# Altium schematic sheet Sensors.SchDoc
size A4
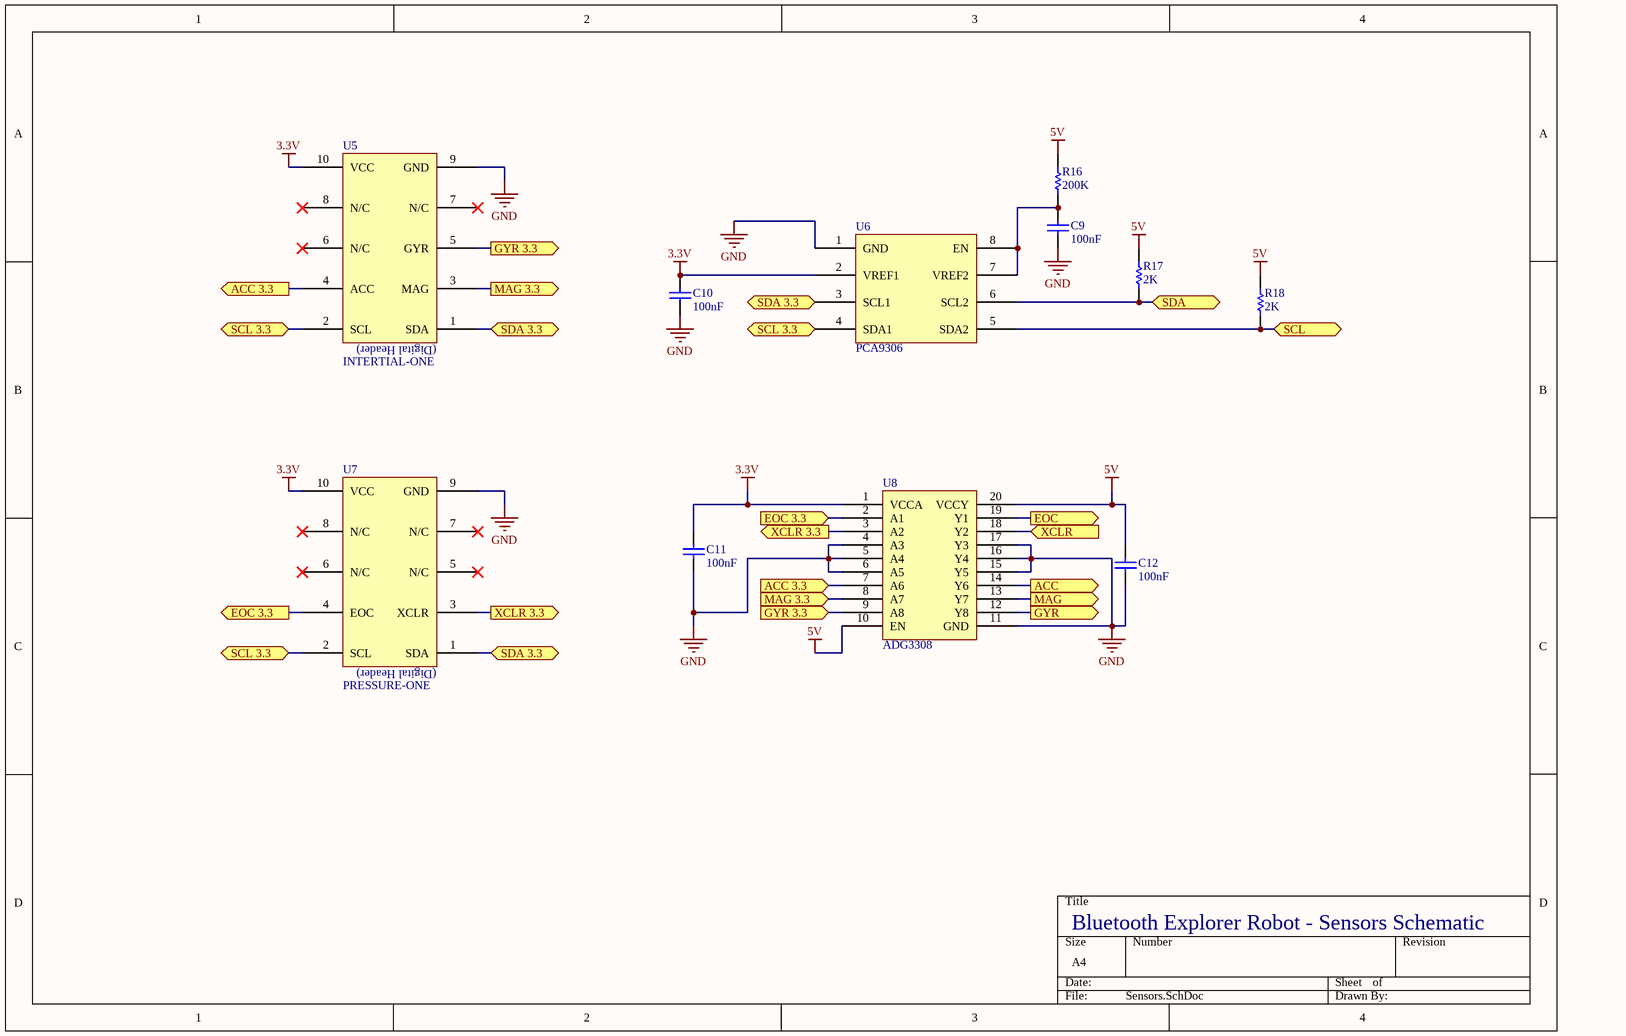
[diagram p0: Sensors.SchDoc]

## Parts
C9  value 100nF  [0805]
C10  value 100nF  [0805]
C11  value 100nF  [0805]
C12  value 100nF  [0805]
R16  value 200K  [2012[0805]]  (hidden comment: Res Semi)
R17  value 2K  [2012[0805]]  (hidden comment: Res Semi)
R18  value 2K  [2012[0805]]  (hidden comment: Res Semi)
U5  INTERTIAL-ONE  [ATMEL-SENS]
U6  PCA9306  [us8]
U7  PRESSURE-ONE  [ATMEL-SENS]
U8  ADG3308  [TSSOP20]

## Ports
ACC 3.3 (in), ACC 3.3 (out), ACC (out), EOC 3.3 (in), EOC 3.3 (out), EOC (out), GYR 3.3 (in), GYR 3.3 (out), GYR (out), MAG 3.3 (in), MAG 3.3 (out), MAG (out), SCL 3.3 (bidir), SCL (bidir), SDA 3.3 (bidir), SDA (bidir), XCLR 3.3 (out), XCLR (in)

## Nets
3.3V: C10.1 C11.1 U5.10(VCC) U6.2(VREF1) U7.10(VCC) U8.1(VCCA)
5V: C12.1 R16.2 R17.2 R18.2 U8.10(EN) U8.20(VCCY)
GND: C9.2 C10.2 C11.2 C12.2 U5.9(GND) U6.1(GND) U7.9(GND) U8.4(A3) U8.5(A4) U8.6(A5) U8.11(GND) U8.15(Y5) U8.16(Y4) U8.17(Y3)
ACC: U8.14(Y6) ; port ACC
ACC 3.3: U5.4(ACC) U8.7(A6) ; port ACC 3.3
EOC: U8.19(Y1) ; port EOC
EOC 3.3: U7.4(EOC) U8.2(A1) ; port EOC 3.3
GYR: U8.12(Y8) ; port GYR
GYR 3.3: U5.5(GYR) U8.9(A8) ; port GYR 3.3
MAG: U8.13(Y7) ; port MAG
MAG 3.3: U5.3(MAG) U8.8(A7) ; port MAG 3.3
SCL: R18.1 U6.5(SDA2) ; port SCL
SCL 3.3: U5.2(SCL) U6.4(SDA1) U7.2(SCL) ; port SCL 3.3
SDA: R17.1 U6.6(SCL2) ; port SDA
SDA 3.3: U5.1(SDA) U6.3(SCL1) U7.1(SDA) ; port SDA 3.3
XCLR: U8.18(Y2) ; port XCLR
XCLR 3.3: U7.3(XCLR) U8.3(A2) ; port XCLR 3.3
NetC9_1: C9.1 R16.1 U6.7(VREF2) U6.8(EN)

Not connected (* = marked no-connect by the designer): U5 6(N/C)* 7(N/C)* 8(N/C)*; U7 5(N/C)* 6(N/C)* 7(N/C)* 8(N/C)*

## Notes on the sheet
- Bluetooth Explorer Robot - Sensors Schematic
- (in symbol INTERTIAL-ONE) (Digital Header)
- (in symbol PRESSURE-ONE) (Digital Header)

## Library data of the parts
C9-C12 = Cap Semi: Capacitor (Semiconductor SIM Model); Published: 8-Jun-2000; LatestRevisionDate: 17-Jul-2002; LatestRevisionNote: Re-released for DXP Platform.; PackageReference: C1206; Publisher: Altium Limited
R16-R18 = Res Semi: Semiconductor Resistor; Published: 8-Jun-2000; LatestRevisionDate: 17-Jul-2002; LatestRevisionNote: Re-released for DXP Platform.; PackageReference: AXIAL-0.5; Publisher: Altium Limited